# Altium schematic sheet LIDO-HW.200.SecurityAndTemperature.SchDoc
size A3; SheetNumber: 13; SheetTotal: 17
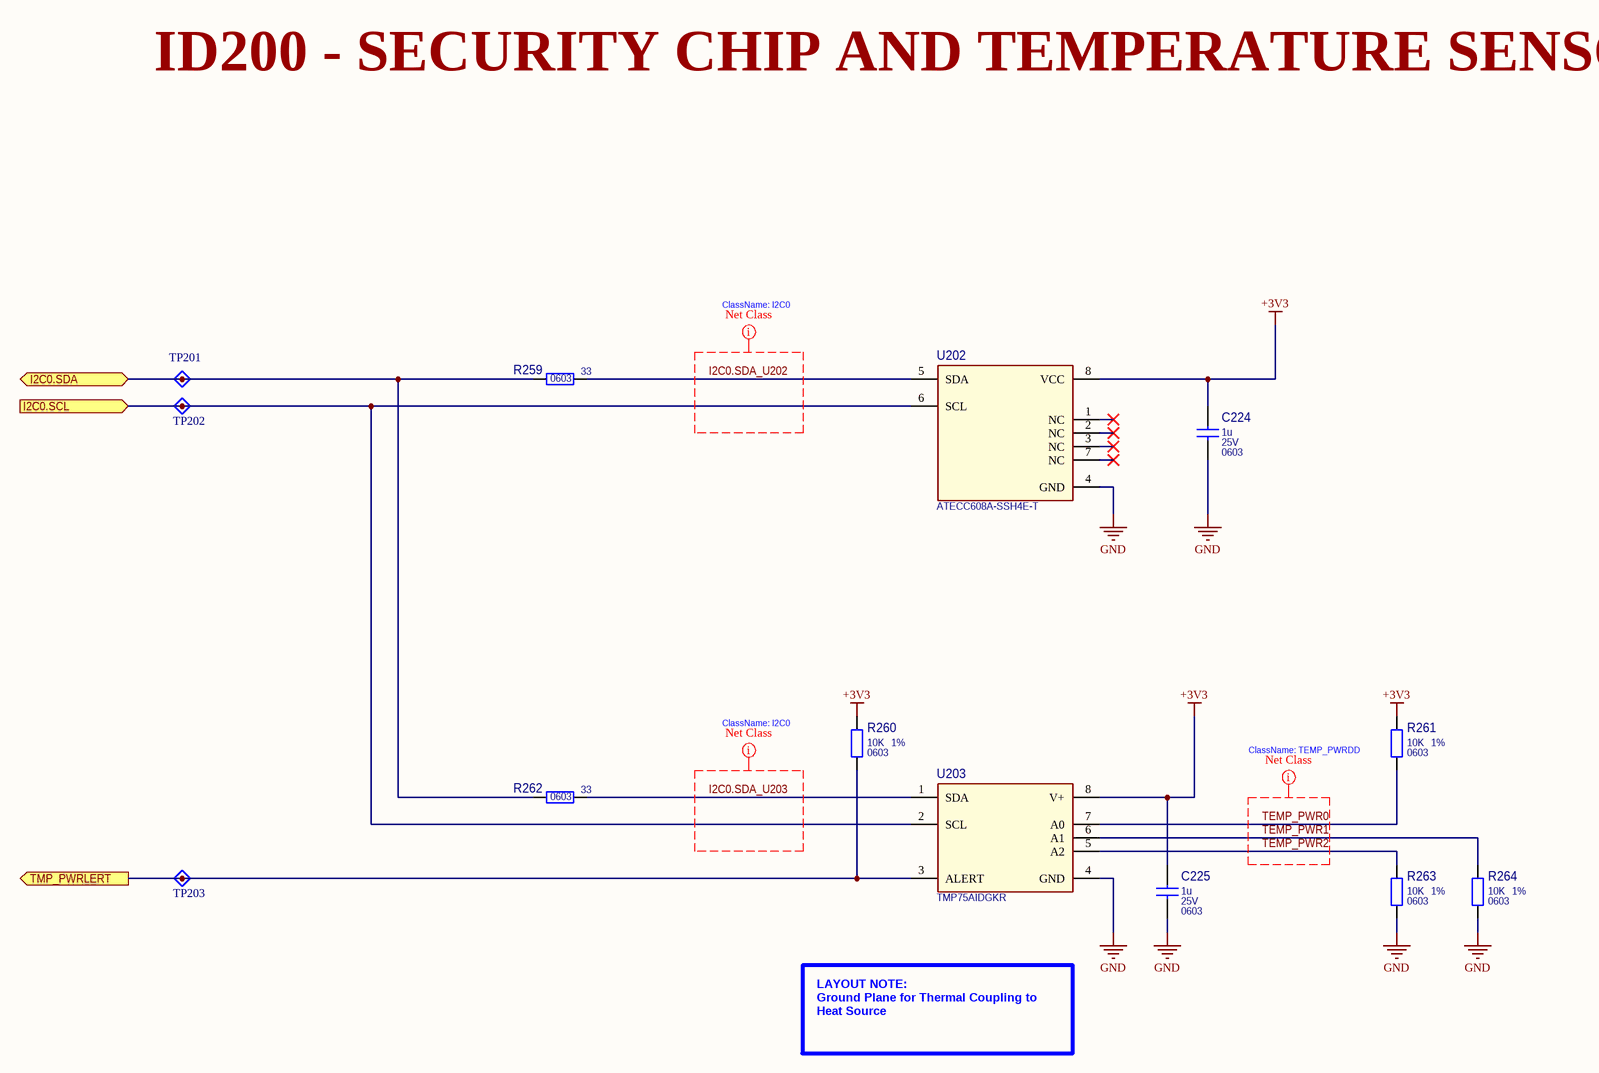
[diagram p0: LIDO-HW.200.SecurityAndTemperature.SchDoc]

## Parts
C224  1u  Part Value 2: 25V  Part Package: 0603  [CAP_0603_1608X90-N_MURATA_A]
C225  1u  Part Value 2: 25V  Part Package: 0603  [CAP_0603_1608X90-N_MURATA_A]
R259  33  Part Package: 0603  [RES_0603_1608X60-N_YAGEO_A]
R260  10K  Part Value 2: 1%  Part Package: 0603  [RES_0603_1608X60-N_YAGEO_A]
R261  10K  Part Value 2: 1%  Part Package: 0603  [RES_0603_1608X60-N_YAGEO_A]
R262  33  Part Package: 0603  [RES_0603_1608X60-N_YAGEO_A]
R263  10K  Part Value 2: 1%  Part Package: 0603  [RES_0603_1608X60-N_YAGEO_A]
R264  10K  Part Value 2: 1%  Part Package: 0603  [RES_0603_1608X60-N_YAGEO_A]
TP201  TestPoint_A  [TESTPOINT_1D_A]  (value not drawn)  (no BOM)
TP202  TestPoint_A  [TESTPOINT_1D_A]  (value not drawn)  (no BOM)
TP203  TestPoint_A  [TESTPOINT_1D_A]  (value not drawn)  (no BOM)
U202  ATECC608A-SSH4E-T  [SOIC8P127_490X600X175L84X41-N_TI_A]
U203  TMP75AIDGKR  [VSSOP8P65_300X490X110L55X32-N_TI_A]

## Ports
I2C0.SCL (in), I2C0.SDA (bidir), TMP_PWRLERT (out)

## Nets
+3V3: C224.1 C225.1 R260.2 R261.2 U202.8(VCC) U203.8(V+)
GND: C224.2 C225.2 R263.1 R264.1 U202.4(GND) U203.4(GND)
I2C0.SCL: TP202.1(TP) U202.6(SCL) U203.2(SCL) ; port I2C0.SCL
I2C0.SDA: R259.1 R262.1 TP201.1(TP) ; port I2C0.SDA
I2C0.SDA_U202: R259.2 U202.5(SDA)
I2C0.SDA_U203: R262.2 U203.1(SDA)
TEMP_PWR0: R261.1 U203.7(A0)
TEMP_PWR1: R264.2 U203.6(A1)
TEMP_PWR2: R263.2 U203.5(A2)
TMP_PWRLERT: R260.1 TP203.1(TP) U203.3(ALERT) ; port TMP_PWRLERT

Not connected (* = marked no-connect by the designer): U202 1(NC)* 2(NC)* 3(NC)* 7(NC)*

## Layout directives
net class I2C0: I2C0.SDA_U202, I2C0.SDA_U203
net class TEMP_PWRDD: TEMP_PWR0, TEMP_PWR1, TEMP_PWR2

## Notes on the sheet
- ID200 - SECURITY CHIP AND TEMPERATURE SENSOR
- ClassName: I2C0
- (near R261) ClassName: TEMP_PWRDD
- LAYOUT NOTE:
  Ground Plane for Thermal Coupling to Heat Source
- Title:
- Size:
- Date:
- A3
- Sheet       of
- Engineer:
- Version:
- Part Number:
- Revision:
- Rev. date:
- Project:
- File:

## Library data of the parts
C224 C225 = 78: CAP CER 1UF 25V X7R 0603; Manufacturer Part Number: CGA3E1X7R1E105M080AE; Manufacturer: TDK Corporation; Obsolete Part: False; Component ID: 78; Part Value: 1u; Part Value 3: X7R; Package Type: SMT
R259 R262 = 121: RES 33 OHM 5% 1/10W 0603; Manufacturer Part Number: RC0603JR-0733RL; Manufacturer: YAGEO; Obsolete Part: False; Component ID: 121; Part Value: 33; Part Value 2: 5%; Part Value 3: 1/10W; Package Type: SMT
R260 R261 R263 R264 = 115: RES 10K OHM 1% 1/10W 0603; Manufacturer Part Number: RC0603FR-0710KL; Manufacturer: YAGEO; Obsolete Part: False; Component ID: 115; Part Value: 10K; Part Value 3: 1/10W; Package Type: SMT
TP201-TP203 = 3: Pad Diamater 1mm; Part: Test Point 1D A; Obsolete Part: False; 00_Name: TP_XXmm; Component ID: 3; 02_Layer: *; 01_Diameter: 1mm
U202 = 1: IC AUTHENTICATION CHIP 8SOIC; Manufacturer: Microchip Technology; Part Package: SOIC-8; Obsolete Part: False; Designer: Dekimo; Ratings: RoHS; Reviewed: Dekimo_30-06-2020; Component ID: 1; Case/Package: 8-SOIC; ComponentType: IC; Design Date: N/A; Manufacturer Part Number: ATECC608A-SSH4E-T; Max Operating Temperature: 85°C; Min Operating Temperature: -40°C; Value: ATECC608A-SSH4E-T; Package Type: SMT
U203 = 3: Temperature Sensor Digital, Local -40°C ~ 125°C 11 b 8-VSSOP; Manufacturer: Texas Instruments; Part Package: VSSOP-8; Part Value: TMP75A; Obsolete Part: False; Designer: Matt Drazenovich; Ratings: RoHS; Reviewed: Dekimo_07-07-2020; Component ID: 3; Case/Package: 8-VSSOP; ComponentType: IC; Manufacturer Part Number: TMP75AIDGKR; Max Operating Temperature: 127°C; Min Operating Temperature: -40°C; Value: TMP75AIDGKR; Design Date: 03-07-2020; Package Type: SMT